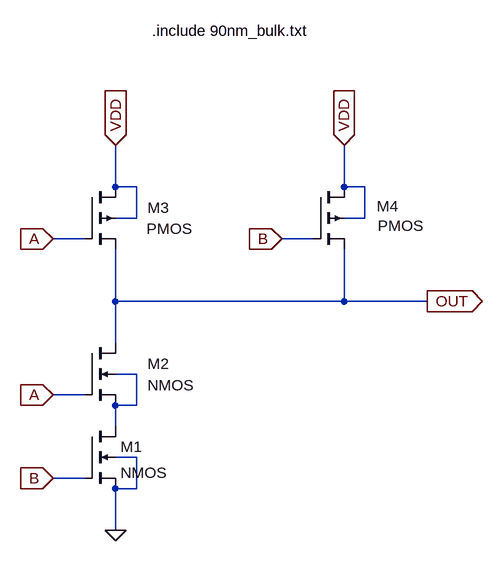
[diagram p0: schematic my-nand.asc]
my-nand.asc, the LTspice schematic file:
Version 4
SHEET 1 924 680
WIRE 224 16 224 -48
WIRE 256 16 224 16
WIRE 576 16 576 -48
WIRE 608 16 576 16
WIRE 256 64 256 16
WIRE 256 64 224 64
WIRE 608 64 608 16
WIRE 608 64 576 64
WIRE 176 96 128 96
WIRE 528 96 480 96
WIRE 224 192 224 112
WIRE 576 192 576 112
WIRE 576 192 224 192
WIRE 704 192 576 192
WIRE 224 256 224 192
WIRE 256 304 224 304
WIRE 176 336 128 336
WIRE 256 352 256 304
WIRE 256 352 224 352
WIRE 224 384 224 352
WIRE 256 432 224 432
WIRE 176 464 128 464
WIRE 256 480 256 432
WIRE 256 480 224 480
WIRE 224 544 224 480
FLAG 576 -48 VDD
IOPIN 576 -48 In
FLAG 224 -48 VDD
IOPIN 224 -48 In
FLAG 704 192 OUT
IOPIN 704 192 Out
FLAG 128 96 A
IOPIN 128 96 In
FLAG 128 336 A
IOPIN 128 336 In
FLAG 480 96 B
IOPIN 480 96 In
FLAG 128 464 B
IOPIN 128 464 In
FLAG 224 544 0
SYMBOL nmos4 176 384 R0
SYMATTR InstName M1
SYMATTR Value2 l=90n w=200n
SYMBOL nmos4 176 256 R0
WINDOW 0 97 32 Left 2
WINDOW 3 97 65 Left 2
SYMATTR InstName M2
SYMATTR Value2 l=90n w=200n
SYMBOL pmos4 176 16 R0
WINDOW 0 97 32 Left 2
WINDOW 3 96 64 Left 2
SYMATTR InstName M3
SYMATTR Value2 l=90n w=400n
SYMBOL pmos4 528 16 R0
WINDOW 0 98 30 Left 2
WINDOW 3 100 60 Left 2
SYMATTR InstName M4
SYMATTR Value2 l=90n w=400n
TEXT 280 -224 Left 2 !.include 90nm_bulk.txt

The netlist it stands for:
* my-nand.asc
M1 N001 B 0 0 NMOS l=90n w=200n
M2 OUT A N001 N001 NMOS l=90n w=200n
M3 VDD A OUT VDD PMOS l=90n w=400n
M4 VDD B OUT VDD PMOS l=90n w=400n
.model NMOS NMOS
.model PMOS PMOS
.lib standard.mos
.include 90nm_bulk.txt
.backanno
.end